# EAGLE design 214_oled (EAGLE 7.6.0)
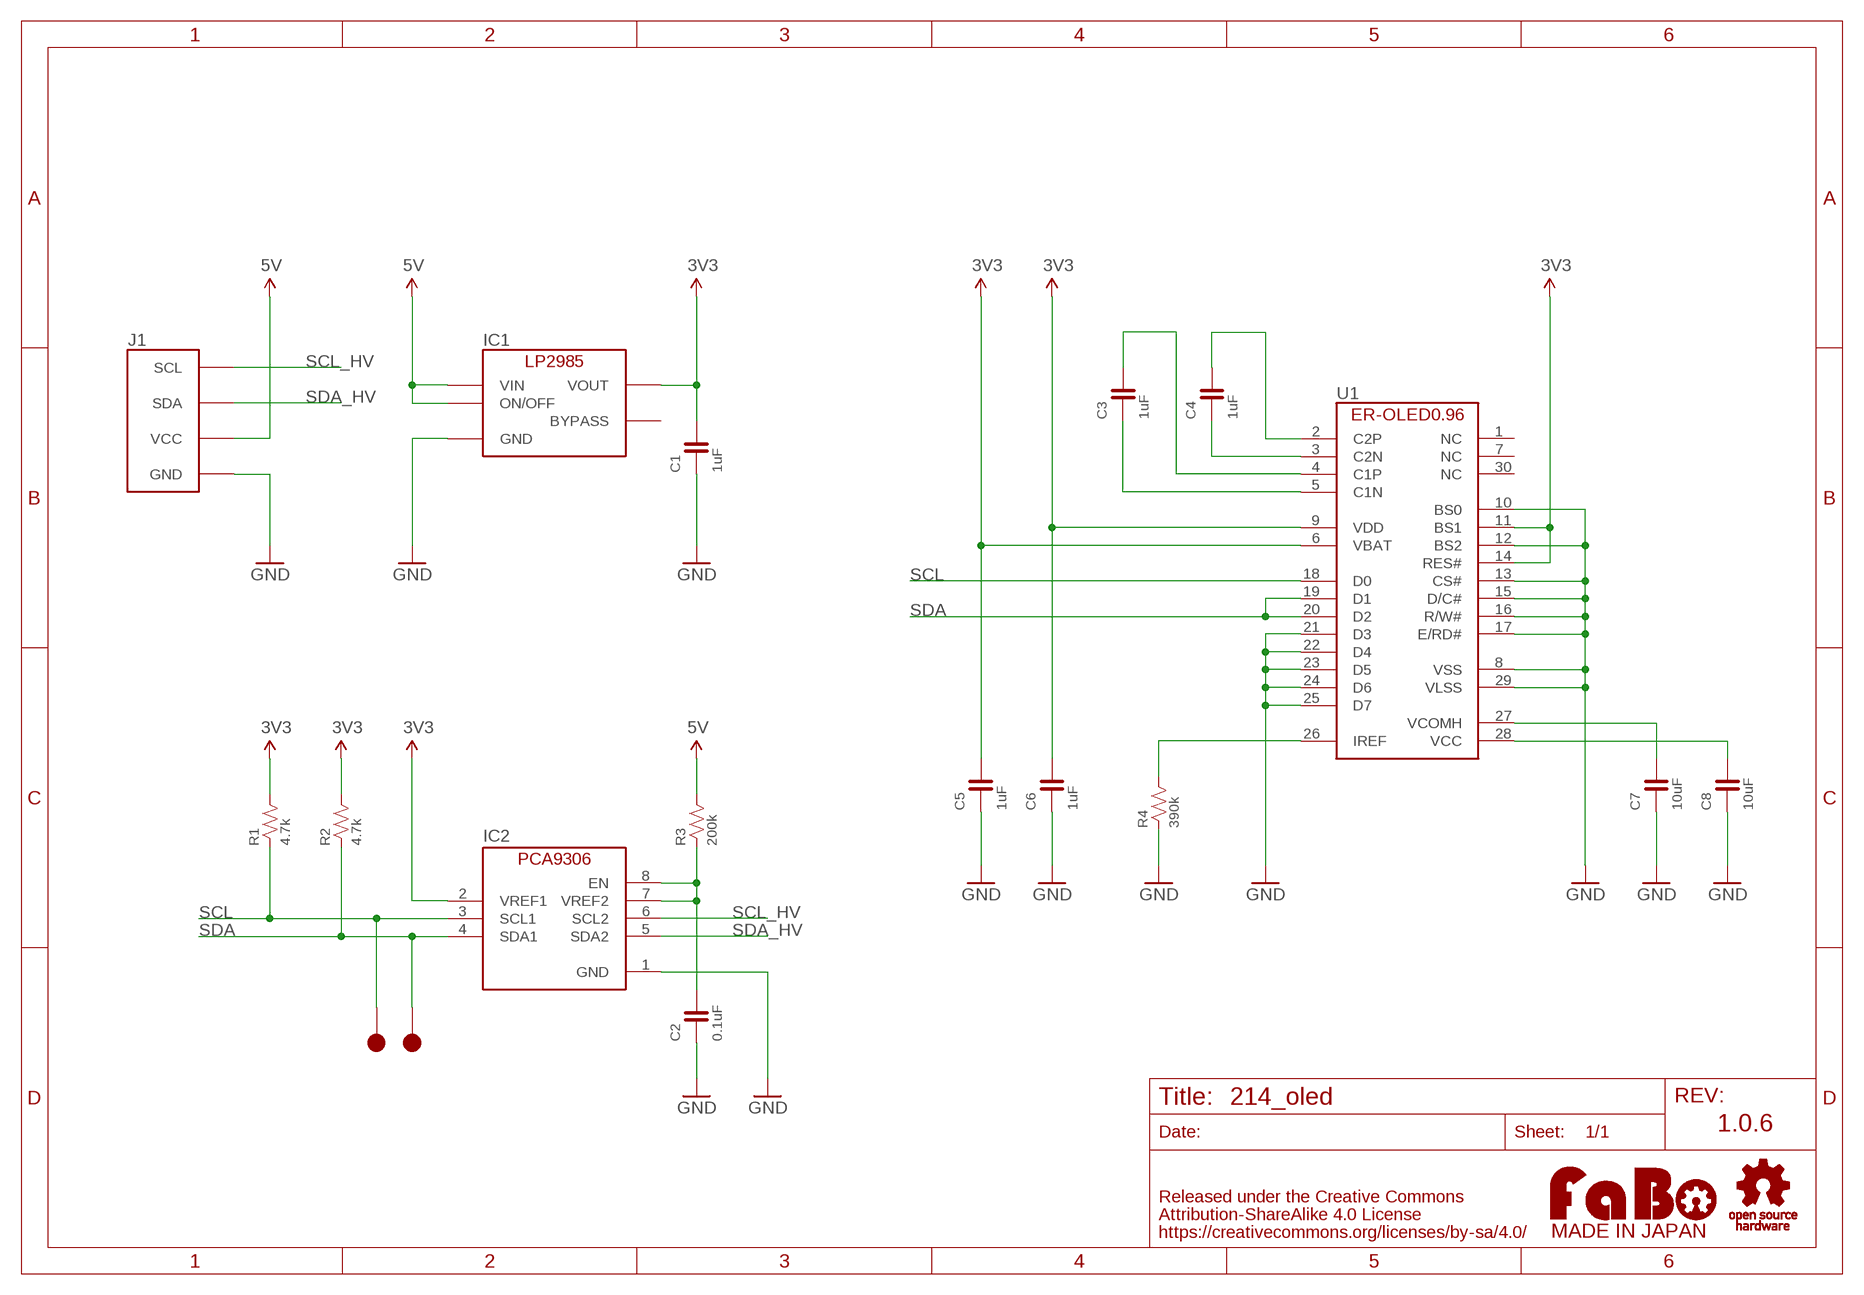
[diagram p0: schematic, sheet 1]

## Parts
C1  1uF  CAPACITOR-0603  [0603]
C2  0.1uF  CAPACITOR-0603  [0603]
C3  1uF  CAPACITOR-0603  [0603]
C4  1uF  CAPACITOR-0603  [0603]
C5  1uF  CAPACITOR-0603  [0603]
C6  1uF  CAPACITOR-0603  [0603]
C7  10uF  CAPACITOR-0603  [0603]
C8  10uF  CAPACITOR-0603  [0603]
IC1  LP2985-33DBV  [SOT-23-5]
IC2  PCA9306GM  [XQFN8]
J1  FABO_BRICK_I2C-OLED  [FABO_BRICK_I2C_OLED]
R1  4.7k  RESISTOR-0603  [0603]
R2  4.7k  RESISTOR-0603  [0603]
R3  200k  RESISTOR-0603  [0603]
R4  390k  RESISTOR-0603  [0603]
TP1  TP-15  [TP-15]
TP2  TP-15  [TP-15]
U1  ER-OLED0.96-1  [ER-OLED0.96-1]
U$2  LOGO_OSHW-M  [LOGO_OSHW_M]
U$3  LOGO_FABO-M_BOTTOM  [LOGO_FABO_MS_BOTTOM]

## Nets
3V3: C1.2 C5.2 C6.2 IC1.5(VOUT) IC2.2(VREF1) R1.2 R2.2 U1.6(VBAT) U1.9(VDD) U1.11(BS1) U1.14(RES#)
5V: IC1.1(VIN) IC1.3(ON/OFF) J1.VCC R3.2
GND: C1.1 C2.1 C5.1 C6.1 C7.1 C8.1 IC1.2(GND) IC2.1(GND) J1.GND R4.1 U1.8(VSS) U1.10(BS0) U1.12(BS2) U1.13(CS#) U1.15(D/C#) U1.16(R/W#) U1.17(E/RD#) U1.21(D3) U1.22(D4) U1.23(D5) U1.24(D6) U1.25(D7) U1.29(VLSS)
N$1: C3.2 U1.4(C1P)
N$2: C3.1 U1.5(C1N)
N$3: C4.1 U1.3(C2N)
N$4: C4.2 U1.2(C2P)
N$5: R4.2 U1.26(IREF)
N$6: C7.2 U1.27(VCOMH)
N$7: C8.2 U1.28(VCC)
N$8: C2.2 IC2.7(VREF2) IC2.8(EN) R3.1
SCL: IC2.3(SCL1) R1.1 TP2.1 U1.18(D0)
SCL_HV: IC2.6(SCL2) J1.SCL
SDA: IC2.4(SDA1) R2.1 TP1.1 U1.19(D1) U1.20(D2)
SDA_HV: IC2.5(SDA2) J1.SDA
Unconnected: IC1.4(BYPASS) U1.1(NC) U1.7(NC) U1.30(NC)

## Notes on the sheet
- 1.0.6

## Library data of the parts
C1-C8 = FaBo-Capacitor:CAPACITOR: CAPACITOR
IC1 = FaBo-Supply:LP2985: LP2985
IC2 = FaBo-LevelTranslator:PCA9306
J1 = FaBo-Template:FABO_BRICK_I2C: FaBo Brick I2C
R1-R4 = FaBo-Resistors:RESISTOR: RESISTOR
TP1 TP2 = FaBo-Supply:TP
U1 = FaBo-Parts:ER-OLED0.96-1
U$2 = FaBo-etc:LOGO_OSHW
U$3 = FaBo-etc:LOGO_FABO

## Board
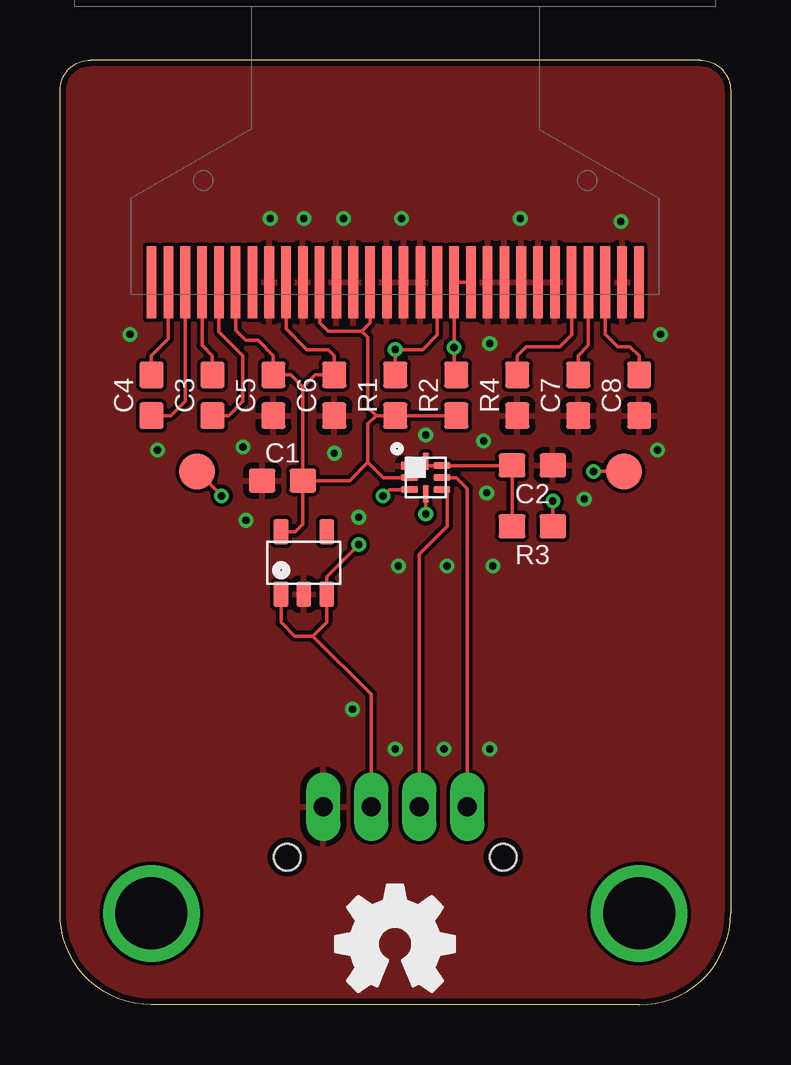
[diagram p1: board, top side]
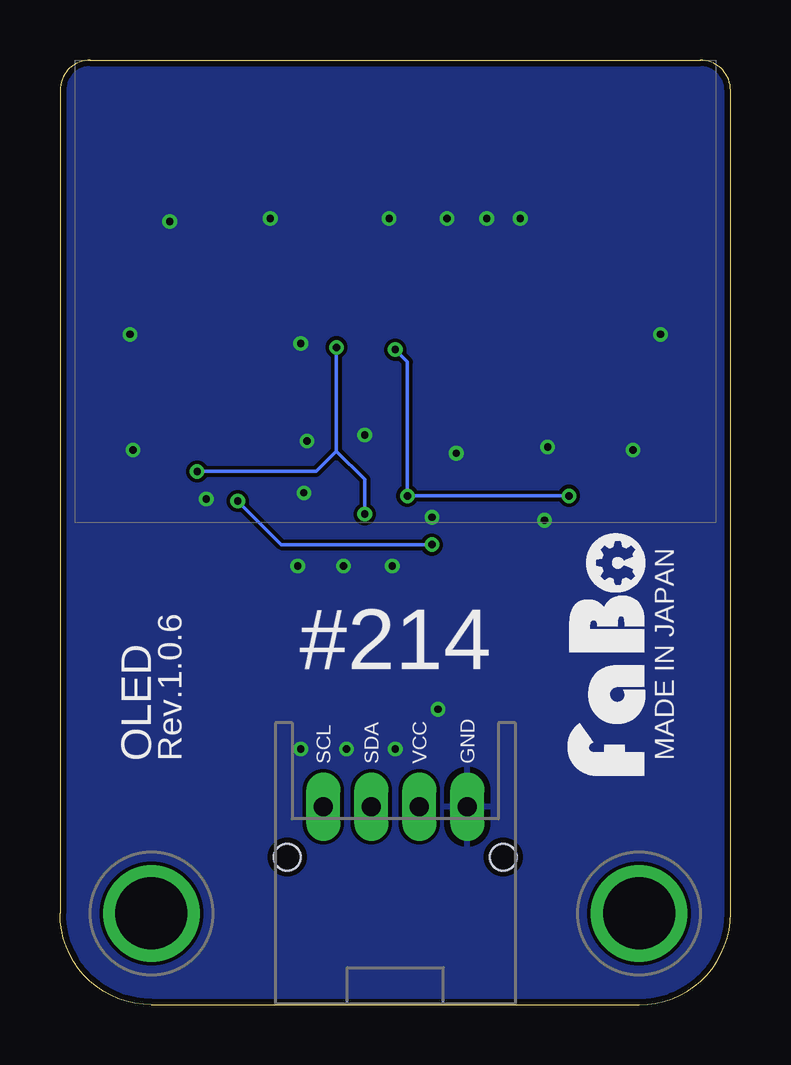
[diagram p2: board, bottom side, seen from below]

Size 27.94 x 39.37 mm. Coordinates in mm from the lower left corner, seen from the top.
Copper layers (1*16): Top 0.035mm / dielectric 1.5mm / Bottom 0.035mm
Design rules "SeeedStudio_2layer_DRU_no_angle_20140221": minimum track width 6mil, minimum drill 12mil, track to track 6mil, track to pad 6mil, pad to pad 6mil, via to via 6mil, smd to smd 0mil, copper to edge 10mil, drill to drill 10mil, minimum pad ring 10mil, minimum via ring 6mil, stop-mask expansion 2mil, vias tented up to drill 100mil, thermal gap 10mil

### Footprints (pad centres in the part's own frame; a part is rotated, then mirrored left to right if it is on the bottom)
0603 = smd 1.1 x 1: 1 -0.85,0; 2 0.85,0
SOT-23-5 = smd 0.6 x 1.05: 1 -0.95,-1.3; 2 0,-1.3; 3 0.95,-1.3; 4 0.95,1.3; 5 -0.95,1.3
XQFN8 = smd 0.7 x 0.35: 1 -0.675,0.5 | smd 0.7 x 0.25: 2 -0.675,0; 3 -0.675,-0.5; 5 0.675,-0.5; 6 0.675,0; 7 0.675,0.5 | smd 0.25 x 0.7: 4 0,-0.675; 8 0,0.675
FABO_BRICK_I2C_OLED = drill 0.8 pad 1.422 long: GND 3,-10.795; SCL -3,-10.795; SDA -1,-10.795; VCC 1,-10.795 | drill 3 pad 3.81: P$1 -10.16,-15.24; P$2 10.16,-15.24 | hole 1.1: -4.5,-12.895; 4.5,-12.895
TP-15 = smd 1.5 x 1.5: 1 0,0
ER-OLED0.96-1 = smd 0.4 x 3: 1 -10.15,-0.5; 2 -9.45,-0.5; 3 -8.75,-0.5; 4 -8.05,-0.5; 5 -7.35,-0.5; 6 -6.65,-0.5; 7 -5.95,-0.5; 8 -5.25,-0.5; 9 -4.55,-0.5; 10 -3.85,-0.5; 11 -3.15,-0.5; 12 -2.45,-0.5; 13 -1.75,-0.5; 14 -1.05,-0.5; 15 -0.35,-0.5; 16 0.35,-0.5; 17 1.05,-0.5; 18 1.75,-0.5; 19 2.45,-0.5; 20 3.15,-0.5; 21 3.85,-0.5; 22 4.55,-0.5; 23 5.25,-0.5; 24 5.95,-0.5; 25 6.65,-0.5; 26 7.35,-0.5; 27 8.05,-0.5; 28 8.75,-0.5; 29 9.45,-0.5; 30 10.15,-0.5

### Placement (x,y rotation side)
C1  9.27,21.84 0 top
C2  19.68,22.48 180 top
C3  6.35,25.4 90 top
C4  3.81,25.4 90 top
C5  8.89,25.4 90 top
C6  11.43,25.4 90 top
C7  21.59,25.4 90 top
C8  24.13,25.4 90 top
IC1  10.16,18.41 0 top
IC2  15.24,21.97 0 top
J1  13.97,19.05 0 bottom
R1  13.97,25.4 270 top
R2  16.51,25.4 270 top
R3  19.68,19.94 0 top
R4  19.05,25.4 90 top
TP1  23.5,22.23 0 top
TP2  5.71,22.23 0 top
U1  13.97,30.61 0 top
U$2  13.97,2.54 0 top
U$3  3.17,14.61 270 top

### Tracks (layer width: path | path; a pad name or v marks a point on that pad's centre or on a via)
3V3
  Top 0.152: U1.6 7.32,28.11 7.75,27.69 8.26,27.69 8.89,27.05 C5.2 9.61,26.25 10.12,25.74 | U1.9 9.42,28.17 10.29,27.3 11.18,27.3 11.43,27.05 C6.2 10.63,26.25 10.12,25.74 | U1.14 12.92,28.41 12.57,28.07 | U1.11 10.82,28.42 11.18,28.07 12.57,28.07 | 13.17,24.55 R1.2 R2.2 | 13.17,24.55 12.83,24.89 12.83,27.81 12.57,28.07 | 12.83,22.61 12.83,24.21 13.17,24.55 | 12.83,22.61 12.06,21.84 C1.2 | C1.2 10.12,25.74 | C1.2 10.12,20.03 9.81,19.71 IC1.5 | IC2.2 13.46,21.97 12.83,22.61
5V  (via drill 0.3)
  Top 0.152: IC1.1 9.21,15.94 9.78,15.37 10.54,15.37 | 10.54,15.37 11.11,15.94 IC1.3 11.11,17.84 v12.45,19.18 | J1.VCC 12.97,12.94 10.54,15.37 | R3.2 v20.54,20.99
  Bottom 0.152: v12.45,19.18 18.72,19.18 v20.54,20.99
GND  (via drill 0.3)
  other vias: 11.43,22.99 15.24,23.75 17.65,23.5 17.78,21.34 19.18,32.77 23.37,32.64 14.22,32.77 11.81,32.77 10.16,32.77 8.76,32.77 2.92,27.94 4.06,23.11 7.62,23.24 7.75,20.19 12.45,20.32 14.1,18.29 16.13,18.29 18.03,18.29 17.91,27.56 25.02,27.94 24.89,23.11 21.84,21.08 12.19,12.32 13.97,10.67 16,10.67 17.91,10.67
  pour Bottom: 0,0 27.94,0 27.94,39.37 0,39.37
  pour Top: 0,0 27.94,0 27.94,39.37 0,39.37
N$1
  Top 0.152: U1.4 5.92,27.48 6.35,27.05 C3.2
N$2
  Top 0.152: U1.5 6.62,28.05 7.62,27.05 7.62,25.15 7.02,24.55 C3.1
N$3
  Top 0.152: C4.1 4.61,24.55 5.22,25.16 U1.3
N$4
  Top 0.152: U1.2 4.52,27.76 3.81,27.05 C4.2
N$5
  Top 0.152: U1.26 21.32,27.92 20.83,27.43 19.43,27.43 19.05,27.05 R4.2
N$6
  Top 0.152: U1.27 22.02,27.48 21.59,27.05 C7.2
N$7
  Top 0.152: U1.28 22.72,27.95 23.24,27.43 23.75,27.43 24.13,27.05 C8.2
N$8
  Top 0.152: R3.1 C2.2 IC2.7 15.24,22.47 IC2.8
SCL  (via drill 0.3)
  Top 0.152: U1.18 15.72,27.91 15.11,27.3 v13.97,27.3 R1.1 | IC2.3 13.72,21.47 v13.46,21.21 | v6.73,21.21 TP2.1
  Bottom 0.152: v13.97,27.3 13.46,26.8 v13.46,21.21 v6.73,21.21
SCL_HV
  Top 0.152: IC2.6 16.51,21.97 16.97,21.51 J1.SCL
SDA  (via drill 0.3)
  Top 0.152: R2.1 16.42,26.34 v16.42,27.39 U1.19 U1.20 | IC2.4 v15.24,20.45 | TP1.1 v22.23,22.23
  Bottom 0.152: v22.23,22.23 17.27,22.23 16.42,23.08 | v16.42,27.39 16.42,23.08 | 16.42,23.08 15.24,21.9 v15.24,20.45
SDA_HV
  Top 0.152: J1.SDA 14.97,18.78 16.13,19.94 16.13,21.34 16.12,21.34 IC2.5

### Text on the board
bPlace: MADE IN JAPAN | #214 | Rev.1.0.6 | OLED